# EAGLE design Batterymonitor (EAGLE 9.1.0)
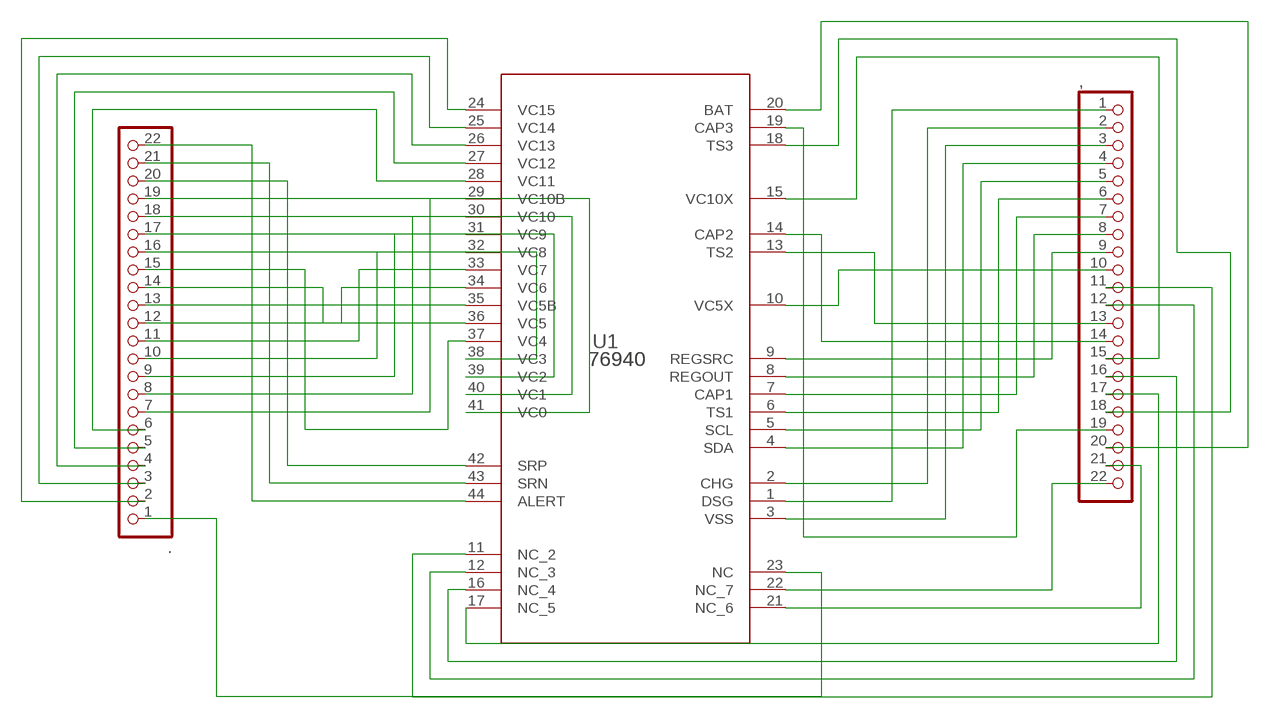
[diagram p0: schematic, sheet 1]

## Parts
,  PINHD-1X22  [1X22]
.  PINHD-1X22  [1X22]
U1  76940  BQ7694000DBTRDBT0044A_L  [DBT0044A_L]

## Nets
N$1: ..14 ..19 U1.36(VC5) U1.41(VC0)
N$2: ,.1 U1.1(DSG)
N$3: ,.2 U1.2(CHG)
N$4: ,.3 U1.3(VSS)
N$5: ,.4 U1.4(SDA)
N$6: ,.5 U1.5(SCL)
N$7: ,.6 U1.6(TS1)
N$8: ,.7 U1.7(CAP1)
N$9: ,.8 U1.8(REGOUT)
N$10: ,.9 U1.9(REGSRC)
N$11: ,.10 U1.10(VC5X)
N$12: ,.11 U1.11(NC_2)
N$13: ,.12 U1.12(NC_3)
N$14: ,.13 U1.13(TS2)
N$15: ,.14 U1.14(CAP2)
N$16: ,.15 U1.15(VC10X)
N$17: ,.16 U1.16(NC_4)
N$18: ,.17 U1.17(NC_5)
N$19: ,.18 U1.18(TS3)
N$20: ,.19 U1.19(CAP3)
N$21: ,.20 U1.20(BAT)
N$22: ,.21 U1.21(NC_6)
N$23: ,.22 U1.22(NC_7)
N$24: ..1 U1.23(NC)
N$25: ..2 U1.24(VC15)
N$26: ..3 U1.25(VC14)
N$27: ..4 U1.26(VC13)
N$28: ..5 U1.27(VC12)
N$29: ..6 U1.28(VC11)
N$30: ..7 U1.29(VC10B)
N$31: ..8 U1.30(VC10)
N$32: ..9 U1.31(VC9)
N$33: ..10 U1.32(VC8)
N$34: ..11 U1.33(VC7)
N$35: ..12 U1.34(VC6)
N$36: ..13 U1.35(VC5B)
N$37: ..15 U1.37(VC4)
N$38: ..16 U1.38(VC3)
N$39: ..17 U1.39(VC2)
N$40: ..18 U1.40(VC1)
N$41: ..21 U1.43(SRN)
N$42: ..20 U1.42(SRP)
N$43: ..22 U1.44(ALERT)

## Library data of the parts
, . = pinhead:PINHD-1X22: PIN HEADER
U1 = ti:BQ7694000DBTR

## Board
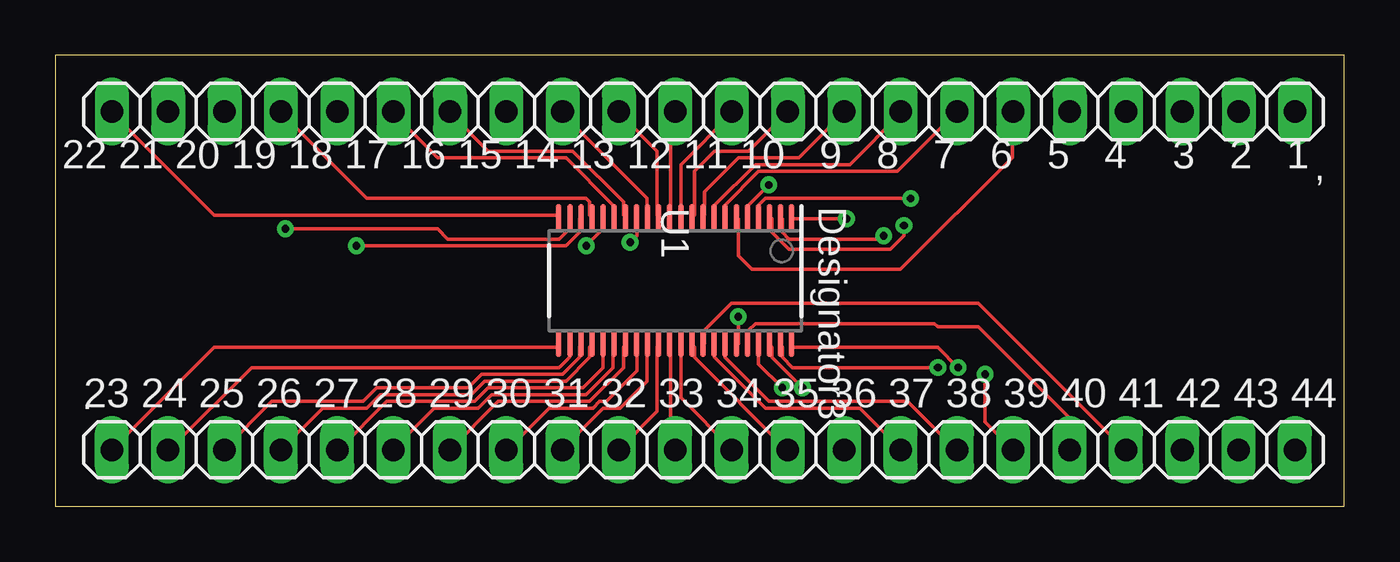
[diagram p1: board, top side]
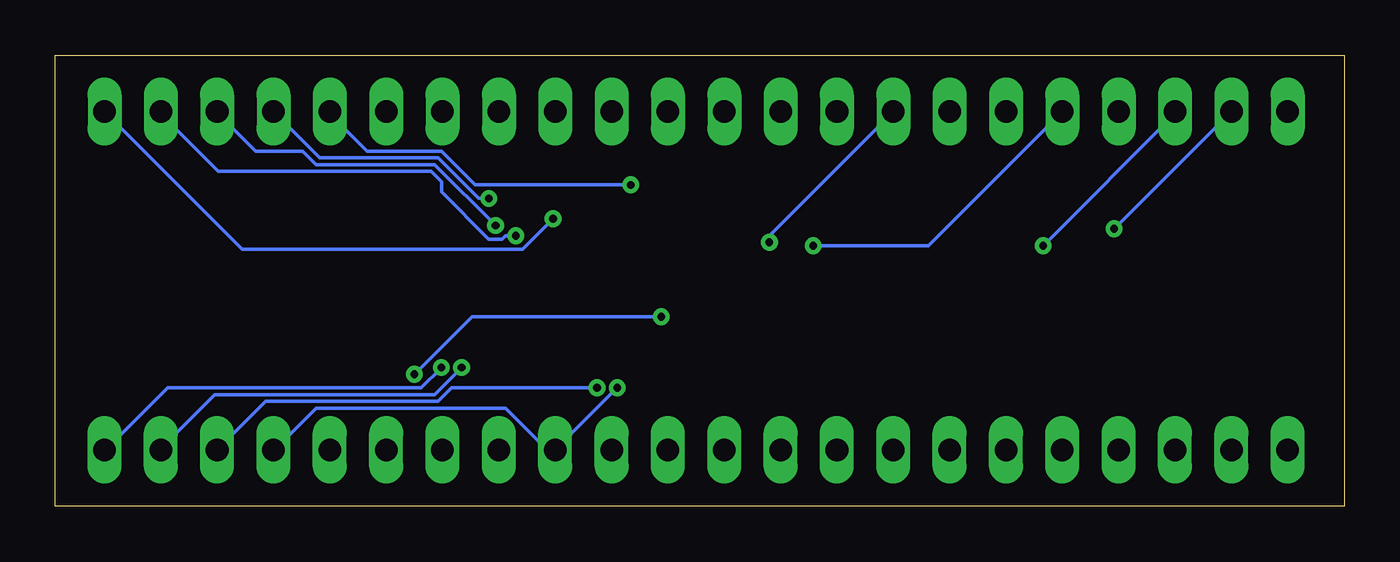
[diagram p2: board, bottom side, seen from below]

Size 58.09 x 20.31 mm. Coordinates in mm from the lower left corner, seen from the top.
Outline: 0,0 58.09,0 58.09,20.31 0,20.31 0,0
Copper layers (1*16): Top 0.035mm / dielectric 1.5mm / Bottom 0.035mm
Design rules "default": minimum track width 6mil, minimum drill 0.35mm, track to track 6mil, track to pad 6mil, pad to pad 6mil, via to via 6mil, smd to smd 6mil, copper to edge 40mil, drill to drill 6mil, minimum pad ring 10mil, minimum via ring 8mil, stop-mask expansion 4mil, vias tented up to drill 0mil, thermal gap 10mil

### Footprints (pad centres in the part's own frame; a part is rotated, then mirrored left to right if it is on the bottom)
1X22 = drill 1.016 long: 1 -26.67,0; 2 -24.13,0; 3 -21.59,0; 4 -19.05,0; 5 -16.51,0; 6 -13.97,0; 7 -11.43,0; 8 -8.89,0; 9 -6.35,0; 10 -3.81,0; 11 -1.27,0; 12 1.27,0; 13 3.81,0; 14 6.35,0; 15 8.89,0; 16 11.43,0; 17 13.97,0; 18 16.51,0; 19 19.05,0; 20 21.59,0; 21 24.13,0; 22 26.67,0
DBT0044A_L = smd 1.2 x 0.25: 1 -2.85,5.25; 2 -2.85,4.75; 3 -2.85,4.25; 4 -2.85,3.75; 5 -2.85,3.25; 6 -2.85,2.75; 7 -2.85,2.25; 8 -2.85,1.75; 9 -2.85,1.25; 10 -2.85,0.75; 11 -2.85,0.25; 12 -2.85,-0.25; 13 -2.85,-0.75; 14 -2.85,-1.25; 15 -2.85,-1.75; 16 -2.85,-2.25; 17 -2.85,-2.75; 18 -2.85,-3.25; 19 -2.85,-3.75; 20 -2.85,-4.25; 21 -2.85,-4.75; 22 -2.85,-5.25; 23 2.85,-5.25; 24 2.85,-4.75; 25 2.85,-4.25; 26 2.85,-3.75; 27 2.85,-3.25; 28 2.85,-2.75; 29 2.85,-2.25; 30 2.85,-1.75; 31 2.85,-1.25; 32 2.85,-0.75; 33 2.85,-0.25; 34 2.85,0.25; 35 2.85,0.75; 36 2.85,1.25; 37 2.85,1.75; 38 2.85,2.25; 39 2.85,2.75; 40 2.85,3.25; 41 2.85,3.75; 42 2.85,4.25; 43 2.85,4.75; 44 2.85,5.25

### Placement (x,y rotation side)
,  29.21,17.78 180 top
.  29.21,2.54 0 top
U1  27.94,10.16 270 top

### Tracks (layer width: path | path; a pad name or v marks a point on that pad's centre or on a via)
N$1  (via drill 0.35)
  Top 0.152: v32.77,5.33 31.7,6.4 31.7,7.16 U1.41 | U1.36 29.26,7.32 29.26,7.92 30.48,9.14 41.6,9.14 48.16,2.59 ..19
  Bottom 0.152: v32.77,5.33 ..14 35.66,2.59 35.97,2.59 37.8,4.42 46.33,4.42 48.16,2.59 ..19
N$2  (via drill 0.35)
  Top 0.152: v35.66,12.95 33.22,12.95 U1.1
  Bottom 0.152: v35.66,12.95 37.03,11.58 49.68,11.58 ,.1
N$3  (via drill 0.35)
  Top 0.152: v37.34,12.19 37.19,12.04 33.07,12.04 32.77,12.34 32.77,12.95 U1.2
  Bottom 0.152: v37.34,12.19 37.8,12.19 37.95,12.04 38.56,12.04 40.69,14.17 40.69,14.63 41.15,15.09 50.75,15.09 53.34,17.68 ,.2
N$4  (via drill 0.35)
  Top 0.152: v38.25,12.65 38.25,12.19 37.64,11.58 33.07,11.58 32.31,12.34 32.31,12.95 U1.3
  Bottom 0.152: v38.25,12.65 41,15.39 46.33,15.39 46.94,16 49.07,16 50.75,17.68 ,.3
N$5  (via drill 0.35)
  Top 0.152: v38.56,13.87 32,13.87 31.7,13.56 31.7,13.11 U1.4
  Bottom 0.152: v38.56,13.87 39.01,13.87 40.84,15.7 46.18,15.7 ,.4
N$6  (via drill 0.35)
  Top 0.152: v32.16,14.48 31.24,13.56 31.24,13.11 U1.5
  Bottom 0.152: v32.16,14.48 39.17,14.48 40.69,16 44.04,16 45.72,17.68 ,.5
N$7
  Top 0.152: U1.6 30.79,12.95 30.79,11.28 31.39,10.67 38.1,10.67 43.13,15.7 43.13,17.68 ,.6
N$8
  Top 0.152: ,.7 37.95,15.09 31.7,15.09 30.18,13.56 30.18,13.11 U1.7
N$9
  Top 0.152: U1.8 29.72,13.11 29.72,13.56 31.55,15.39 35.81,15.39 38.1,17.68 ,.8
N$10
  Top 0.152: U1.9 29.26,13.11 29.26,14.17 30.79,15.7 33.53,15.7 35.51,17.68 ,.9
N$11
  Top 0.152: ,.10 31.24,16 29.72,16 28.8,15.09 28.8,13.11 U1.10
N$12
  Top 0.152: U1.11 28.19,13.11 28.19,15.39 30.48,17.68 ,.11
N$13
  Top 0.152: U1.12 27.74,13.11 27.74,17.53 27.89,17.68 ,.12
N$14
  Top 0.152: U1.13 27.13,13.11 27.13,16 25.45,17.68 ,.13
N$15
  Top 0.152: U1.14 26.67,13.11 26.67,13.87 22.86,17.68 ,.14
N$16  (via drill 0.35)
  Top 0.152: v25.91,11.89 26.21,12.19 26.21,12.95 U1.15
  Bottom 0.152: v25.91,11.89 25.91,12.19 ,.15
N$17
  Top 0.152: U1.16 25.6,13.11 25.6,13.72 23.32,16 19.51,16 17.83,17.68 ,.16
N$18
  Top 0.152: U1.17 25.15,13.11 25.15,13.56 23.01,15.7 17.22,15.7 15.24,17.68 ,.17
N$19  (via drill 0.35)
  Top 0.152: v23.93,11.73 24.69,12.5 24.69,12.95 U1.18
  Bottom 0.152: v23.93,11.73 18.75,11.73 ,.18
N$20
  Top 0.152: U1.19 24.08,13.11 24.08,13.72 23.93,13.87 14.02,13.87 10.21,17.68 ,.19
N$21  (via drill 0.35)
  Top 0.152: v13.56,11.73 23.01,11.73 23.62,12.34 23.62,12.95 U1.20
  Bottom 0.152: v13.56,11.73 7.62,17.68 ,.20
N$22  (via drill 0.35)
  Top 0.152: v10.36,12.5 17.22,12.5 17.68,12.04 22.71,12.04 23.16,12.5 23.16,12.95 U1.21
  Bottom 0.152: ,.21 v10.36,12.5
N$23
  Top 0.152: U1.22 22.71,13.11 7.16,13.11 2.59,17.68 ,.22
N$24
  Top 0.152: ..1 7.16,7.16 22.71,7.16 U1.23
N$25
  Top 0.152: U1.24 23.16,7.16 23.16,6.71 22.71,6.25 8.84,6.25 5.18,2.59 ..2
N$26
  Top 0.152: U1.25 23.62,7.16 23.62,6.71 22.86,5.94 19.2,5.94 18.59,5.33 14.48,5.33 13.87,4.72 9.75,4.72 7.62,2.59 ..3
N$27
  Top 0.152: ..4 12.04,4.42 14.02,4.42 14.63,5.03 18.75,5.03 19.36,5.64 23.01,5.64 24.08,6.71 24.08,7.16 U1.26
N$28
  Top 0.152: U1.27 24.69,7.16 24.69,6.25 23.77,5.33 19.51,5.33 18.9,4.72 14.94,4.72 12.8,2.59 ..5
N$29
  Top 0.152: U1.28 25.15,7.16 25.15,6.25 23.93,5.03 19.66,5.03 19.05,4.42 17.07,4.42 15.24,2.59 ..6
N$30
  Top 0.152: ..7 19.96,4.72 24.08,4.72 25.6,6.25 25.6,7.16 U1.29
N$31
  Top 0.152: U1.30 26.21,7.16 26.21,6.1 24.84,4.72 24.54,4.72 24.23,4.42 22.25,4.42 20.42,2.59 ..8
N$32
  Top 0.152: U1.31 26.67,7.16 26.67,5.64 25.45,4.42 24.69,4.42 22.86,2.59 ..9
N$33
  Top 0.152: ..10 27.13,4.27 27.13,7.16 U1.32
N$34
  Top 0.152: ..11 27.74,2.74 27.74,7.16 U1.33
N$35
  Top 0.152: U1.34 28.19,7.16 28.19,4.88 30.48,2.59 ..12
N$36
  Top 0.152: U1.35 28.8,7.16 28.8,6.71 32.92,2.59 ..13
N$37
  Top 0.152: U1.37 29.72,7.16 29.72,6.71 32,4.42 36.27,4.42 38.1,2.59 ..15
N$38
  Top 0.152: U1.38 30.18,7.16 30.18,6.71 32.16,4.72 38.41,4.72 40.54,2.59 ..16
N$39  (via drill 0.35)
  Top 0.152: v30.79,8.53 30.79,7.32 U1.39 | v41.91,5.94 41.91,3.81 ..17
  Bottom 0.152: v30.79,8.53 39.32,8.53 v41.91,5.94
N$40
  Top 0.152: ..18 45.72,3.96 41.6,8.08 39.78,8.08 39.62,8.23 31.55,8.23 31.24,7.92 31.24,7.32 U1.40
N$41  (via drill 0.35)
  Top 0.152: v39.78,6.25 33.22,6.25 32.77,6.71 32.77,7.16 U1.43
  Bottom 0.152: v39.78,6.25 41,5.03 50.9,5.03 53.34,2.59 ..21
N$42  (via drill 0.35)
  Top 0.152: v33.68,5.33 32.31,6.71 32.31,7.16 U1.42
  Bottom 0.152: v33.68,5.33 40.23,5.33 40.84,4.72 48.62,4.72 ..20
N$43  (via drill 0.35)
  Top 0.152: v40.69,6.25 39.78,7.16 33.22,7.16 U1.44
  Bottom 0.152: v40.69,6.25 41.6,5.33 53.03,5.33 55.78,2.59 ..22

### Text on the board
tNames: 22 21 20 19 18 17 16 15 14 13 12 11 10 9 8 7 6 5 4 3 2 1 | 23 24 25 26 27 28 29 30 31 32 33 34 35 36 37 38 39 40 41 42 43 44